# EAGLE design EurocardBackplane-test (EAGLE 6.6.0)

## Sheet 1 of 2
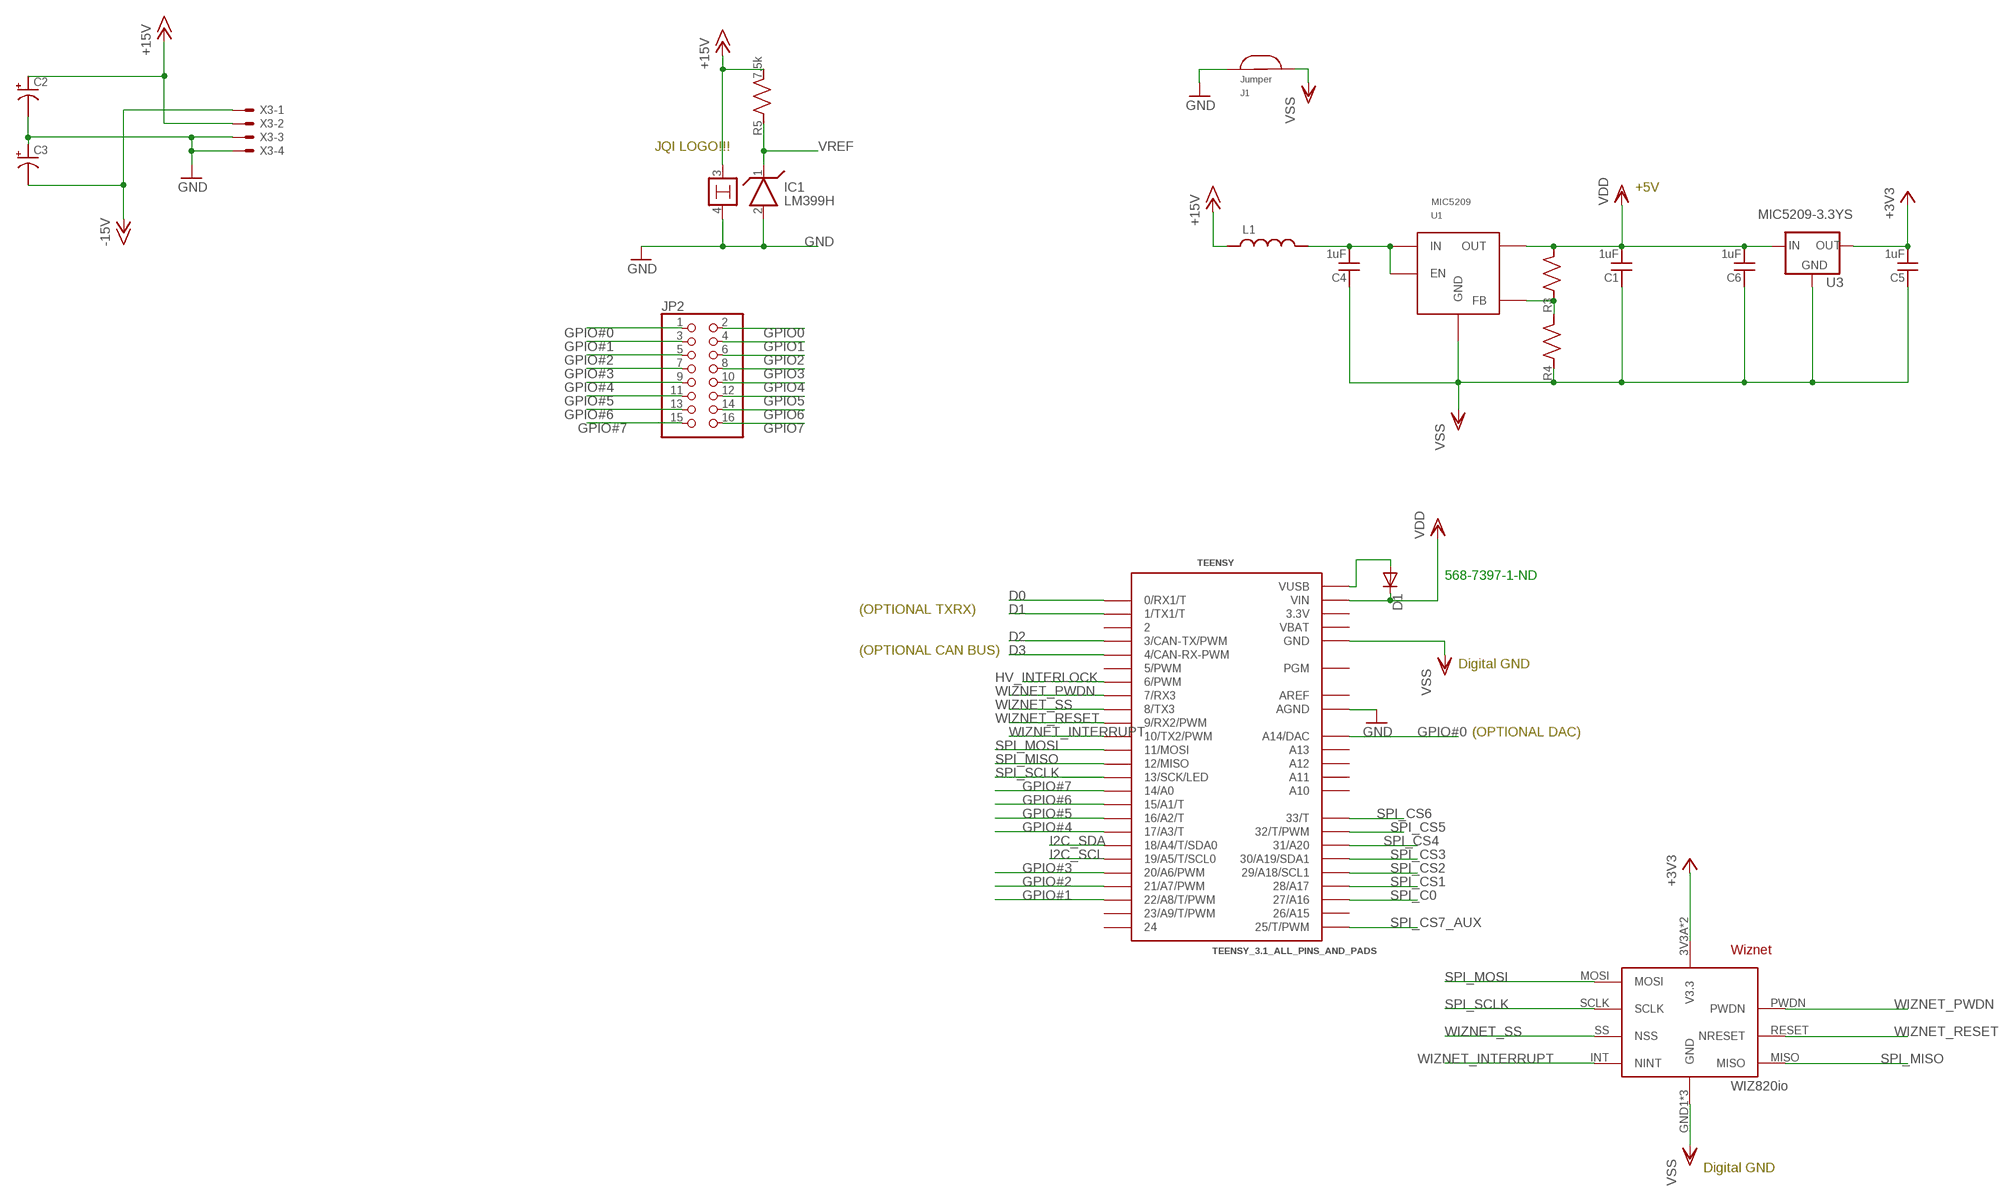
[diagram p0: schematic, sheet 1]

### Parts
C1  1uF  C_MLCC_SMDCMLCC_0603  [C_MLCC_0603]
C2  C_POL_SMDF  [PANASONIC_F]
C3  C_POL_SMDF  [PANASONIC_F]
C4  1uF  C_MLCC_SMDCMLCC_0603  [C_MLCC_0603]
C5  1uF  C_MLCC_SMDCMLCC_0603  [C_MLCC_0603]
C6  1uF  C_MLCC_SMDCMLCC_0603  [C_MLCC_0603]
D1  DIODE-SOD523  [SOD523]
IC1  LM399H  [TO39/4]
J1  JUMPER  [JUMP]
JP2  PINHD-2X8  [2X08]
L1  L_FERRITE_SMDLFERRITE_0805  [R_0805]
R3  R_SMDR0603  [R_0603]
R4  R_SMDR0603  [R_0603]
R5  7.5k  R_SMDR0603  [R_0603]
TEENSY  TEENSY_3.1_ALL_PINS_AND_PADS  [TEENSY_3.1_ALLPINS]
U1  MIC5209  [TO263-5]
U2  WIZ820IO  [WIZNET]
U3  MIC5209-3.3YS  MIC5209-FIXED  [SOT223-S]
X3  5566-4  [5566-4]

### Nets
+3V3: C5.P$2 U2.3V3A(V3.3) U2.3V3B(V3.3) U3.3(OUT)
+15V: C2.+ IC1.3 L1.P$1 R5.P$2 X3.2 ; also sheet 2
-15V: C3.- X3.1 ; also sheet 2
D0: TEENSY.0(0/RX1/T) ; also sheet 2
D1: TEENSY.1(1/TX1/T) ; also sheet 2
D2: TEENSY.3(3/CAN-TX/PWM) ; also sheet 2
D3: TEENSY.4(4/CAN-RX-PWM) ; also sheet 2
GND: C2.- C3.+ IC1.2 IC1.4 J1.P$2 TEENSY.AGND X3.3 X3.4 ; also sheet 2
GPIO0: JP2.2 ; also sheet 2
GPIO1: JP2.4 ; also sheet 2
GPIO2: JP2.6 ; also sheet 2
GPIO3: JP2.8 ; also sheet 2
GPIO4: JP2.10 ; also sheet 2
GPIO5: JP2.12 ; also sheet 2
GPIO6: JP2.14 ; also sheet 2
GPIO7: JP2.16 ; also sheet 2
GPIO#0: JP2.1 TEENSY.A14(A14/DAC)
GPIO#1: JP2.3 TEENSY.22/A8(22/A8/T/PWM)
GPIO#2: JP2.5 TEENSY.21/A7(21/A7/PWM)
GPIO#3: JP2.7 TEENSY.20/A6(20/A6/PWM)
GPIO#4: JP2.9 TEENSY.17/A3(17/A3/T)
GPIO#5: JP2.11 TEENSY.16/A2(16/A2/T)
GPIO#6: JP2.13 TEENSY.15/A1(15/A1/T)
GPIO#7: JP2.15 TEENSY.14/A0
HV_INTERLOCK: TEENSY.6(6/PWM) ; also sheet 2
I2C_SCL: TEENSY.19/A5(19/A5/T/SCL0) ; also sheet 2
I2C_SDA: TEENSY.18/A4(18/A4/T/SDA0) ; also sheet 2
N$1: C4.P$2 L1.P$2 U1.1(EN) U1.2(IN)
N$2: D1.A TEENSY.VUSB
N$5: R3.P$1 R4.P$2 U1.5(FB)
SPI_C0: TEENSY.27(27/A16)
SPI_CS1: TEENSY.28(28/A17)
SPI_CS2: TEENSY.29(29/A18/SCL1)
SPI_CS3: TEENSY.30(30/A19/SDA1)
SPI_CS4: TEENSY.31(31/A20)
SPI_CS5: TEENSY.32(32/T/PWM) ; also sheet 2
SPI_CS6: TEENSY.33(33/T) ; also sheet 2
SPI_CS7_AUX: TEENSY.25(25/T/PWM) ; also sheet 2
SPI_MISO: TEENSY.12(12/MISO) U2.MISO ; also sheet 2
SPI_MOSI: TEENSY.11(11/MOSI) U2.MOSI ; also sheet 2
SPI_SCLK: TEENSY.13(13/SCK/LED) U2.SCLK ; also sheet 2
VDD: C1.P$2 C6.P$2 D1.C R3.P$2 TEENSY.VIN U1.4(OUT) U3.1(IN)
VREF: IC1.1 R5.P$1 ; also sheet 2
VSS: C1.P$1 C4.P$1 C5.P$1 C6.P$1 J1.P$1 R4.P$1 TEENSY.GND TEENSY.GND1(GND) TEENSY.GND2(GND) U1.3(GND) U1.6(GND) U2.GND1(GND) U2.GND2(GND) U2.GND3(GND) U3.2(GND) U3.4(GND)
WIZNET_INTERRUPT: TEENSY.10(10/TX2/PWM) U2.INT(NINT)
WIZNET_PWDN: TEENSY.7(7/RX3) U2.PWDN
WIZNET_RESET: TEENSY.9(9/RX2/PWM) U2.RESET(NRESET)
WIZNET_SS: TEENSY.8(8/TX3) U2.SS(NSS)
Unconnected: TEENSY.2 TEENSY.5(5/PWM) TEENSY.23/A9(23/A9/T/PWM) TEENSY.24 TEENSY.26(26/A15) TEENSY.A10 TEENSY.A11 TEENSY.A12 TEENSY.A13 TEENSY.PGM

### Notes on the sheet
- JQI LOGO!!!
- +5V
- 568-7397-1-ND
- (OPTIONAL TXRX)
- (OPTIONAL CAN BUS)
- Digital GND
- (OPTIONAL DAC)
- Digital GND

## Sheet 2 of 2
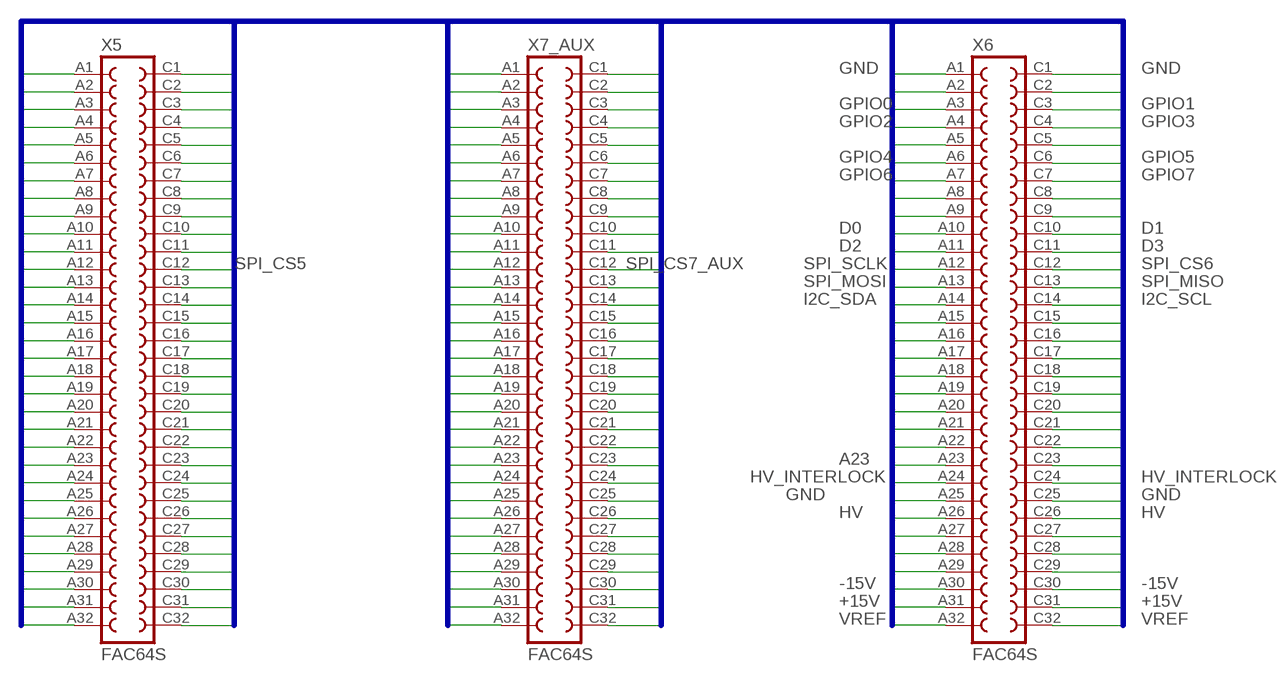
[diagram p1: schematic, sheet 2]

### Parts
X5  FAC64S  [FAC64S]
X6  FAC64S  [FAC64S]
X7_AUX  FAC64S  [FAC64S]

### Nets
+15V: X5.A31 X5.C31 X6.A31 X6.C31 X7_AUX.A31 X7_AUX.C31 ; also sheet 1
-15V: X5.A30 X5.C30 X6.A30 X6.C30 X7_AUX.A30 X7_AUX.C30 ; also sheet 1
A2: X5.A2 X6.A2 X7_AUX.A2
A5: X5.A5 X6.A5 X7_AUX.A5
A8: X5.A8 X6.A8 X7_AUX.A8
A9: X5.A9 X6.A9 X7_AUX.A9
A15: X5.A15 X6.A15 X7_AUX.A15
A16: X5.A16 X6.A16 X7_AUX.A16
A17: X5.A17 X6.A17 X7_AUX.A17
A18: X5.A18 X6.A18 X7_AUX.A18
A19: X5.A19 X6.A19 X7_AUX.A19
A20: X5.A20 X6.A20 X7_AUX.A20
A21: X5.A21 X6.A21 X7_AUX.A21
A22: X5.A22 X6.A22 X7_AUX.A22
A23: X5.A23 X6.A23 X7_AUX.A23
A27: X5.A27 X6.A27 X7_AUX.A27
A28: X5.A28 X6.A28 X7_AUX.A28
A29: X5.A29 X6.A29 X7_AUX.A29
C2: X5.C2 X6.C2 X7_AUX.C2
C5: X5.C5 X6.C5 X7_AUX.C5
C8: X5.C8 X6.C8 X7_AUX.C8
C9: X5.C9 X6.C9 X7_AUX.C9
C15: X5.C15 X6.C15 X7_AUX.C15
C16: X5.C16 X6.C16 X7_AUX.C16
C17: X5.C17 X6.C17 X7_AUX.C17
C18: X5.C18 X6.C18 X7_AUX.C18
C19: X5.C19 X6.C19 X7_AUX.C19
C20: X5.C20 X6.C20 X7_AUX.C20
C21: X5.C21 X6.C21 X7_AUX.C21
C22: X5.C22 X6.C22 X7_AUX.C22
C23: X5.C23 X6.C23 X7_AUX.C23
C27: X5.C27 X6.C27 X7_AUX.C27
C28: X5.C28 X6.C28 X7_AUX.C28
C29: X5.C29 X6.C29 X7_AUX.C29
D0: X5.A10 X6.A10 X7_AUX.A10 ; also sheet 1
D1: X5.C10 X6.C10 X7_AUX.C10 ; also sheet 1
D2: X5.A11 X6.A11 X7_AUX.A11 ; also sheet 1
D3: X5.C11 X6.C11 X7_AUX.C11 ; also sheet 1
GND: X5.A1 X5.A25 X5.C1 X5.C25 X6.A1 X6.A25 X6.C1 X6.C25 X7_AUX.A1 X7_AUX.A25 X7_AUX.C1 X7_AUX.C25 ; also sheet 1
GPIO0: X5.A3 X6.A3 X7_AUX.A3 ; also sheet 1
GPIO1: X5.C3 X6.C3 X7_AUX.C3 ; also sheet 1
GPIO2: X5.A4 X6.A4 X7_AUX.A4 ; also sheet 1
GPIO3: X5.C4 X6.C4 X7_AUX.C4 ; also sheet 1
GPIO4: X5.A6 X6.A6 X7_AUX.A6 ; also sheet 1
GPIO5: X5.C6 X6.C6 X7_AUX.C6 ; also sheet 1
GPIO6: X5.A7 X6.A7 X7_AUX.A7 ; also sheet 1
GPIO7: X5.C7 X6.C7 X7_AUX.C7 ; also sheet 1
HV: X5.A26 X5.C26 X6.A26 X6.C26 X7_AUX.A26 X7_AUX.C26
HV_INTERLOCK: X5.A24 X5.C24 X6.A24 X6.C24 X7_AUX.A24 X7_AUX.C24 ; also sheet 1
I2C_SCL: X5.C14 X6.C14 X7_AUX.C14 ; also sheet 1
I2C_SDA: X5.A14 X6.A14 X7_AUX.A14 ; also sheet 1
SPI_CS5: X5.C12 ; also sheet 1
SPI_CS6: X6.C12 ; also sheet 1
SPI_CS7_AUX: X7_AUX.C12 ; also sheet 1
SPI_MISO: X5.C13 X6.C13 X7_AUX.C13 ; also sheet 1
SPI_MOSI: X5.A13 X6.A13 X7_AUX.A13 ; also sheet 1
SPI_SCLK: X5.A12 X6.A12 X7_AUX.A12 ; also sheet 1
VREF: X5.A32 X5.C32 X6.A32 X6.C32 X7_AUX.A32 X7_AUX.C32 ; also sheet 1

### Buses
A[1..32],C[1..32]

## Power pins joined to a net without a drawn wire
3.3V: TEENSY.3.3V TEENSY.3.3V1(3.3V) TEENSY.3.3V2(3.3V)
AREF: TEENSY.AREF
VBAT: TEENSY.VBAT

## Library data of the parts
C1 C4-C6 = jqi_passives:C_MLCC_SMD
C2 C3 = jqi_passives:C_POL_SMD
D1 = diode:DIODE-: DIODE
IC1 = Eurocard-Backplane-jqi:LM399H: Precision Z DIODE
J1 = Eurocard-Backplane-jqi:JUMPER
JP2 = pinhead:PINHD-2X8: PIN HEADER
L1 = jqi_passives:L_FERRITE_SMD
R3-R5 = jqi_passives:R_SMD
TEENSY = mcu-accessories:TEENSY_3.1_ALL_PINS_AND_PADS: Footprint for Teensy 3.1 board using all pads and all through-holes. Pads need a 2x7 0.1" SMD header.
U1 = regulator-jqi:MIC5209: MIC5209YU Adjustable regulator, 500mA. Vout = 1.242(1+R2/R1), R2 less than 470k (top of divider partition).
U2 = mcu-accessories:WIZ820IO: WIZNET ethernet eval board
U3 = regulator-jqi:MIC5209-FIXED: MIC5209 positive fixed Vreg, 500mA
X3 = Eurocard-Backplane-jqi:5566-4: Mini FIT connector 4 pol Source: http://www.molex.com; OC_FARNELL: unknown; OC_NEWARK: unknown
X5 X6 X7_AUX = Eurocard-Backplane-jqi:FAC64S: CONNECTOR female, 64 pins, block, type C, rows AC, grid 5.08 mm

## Board
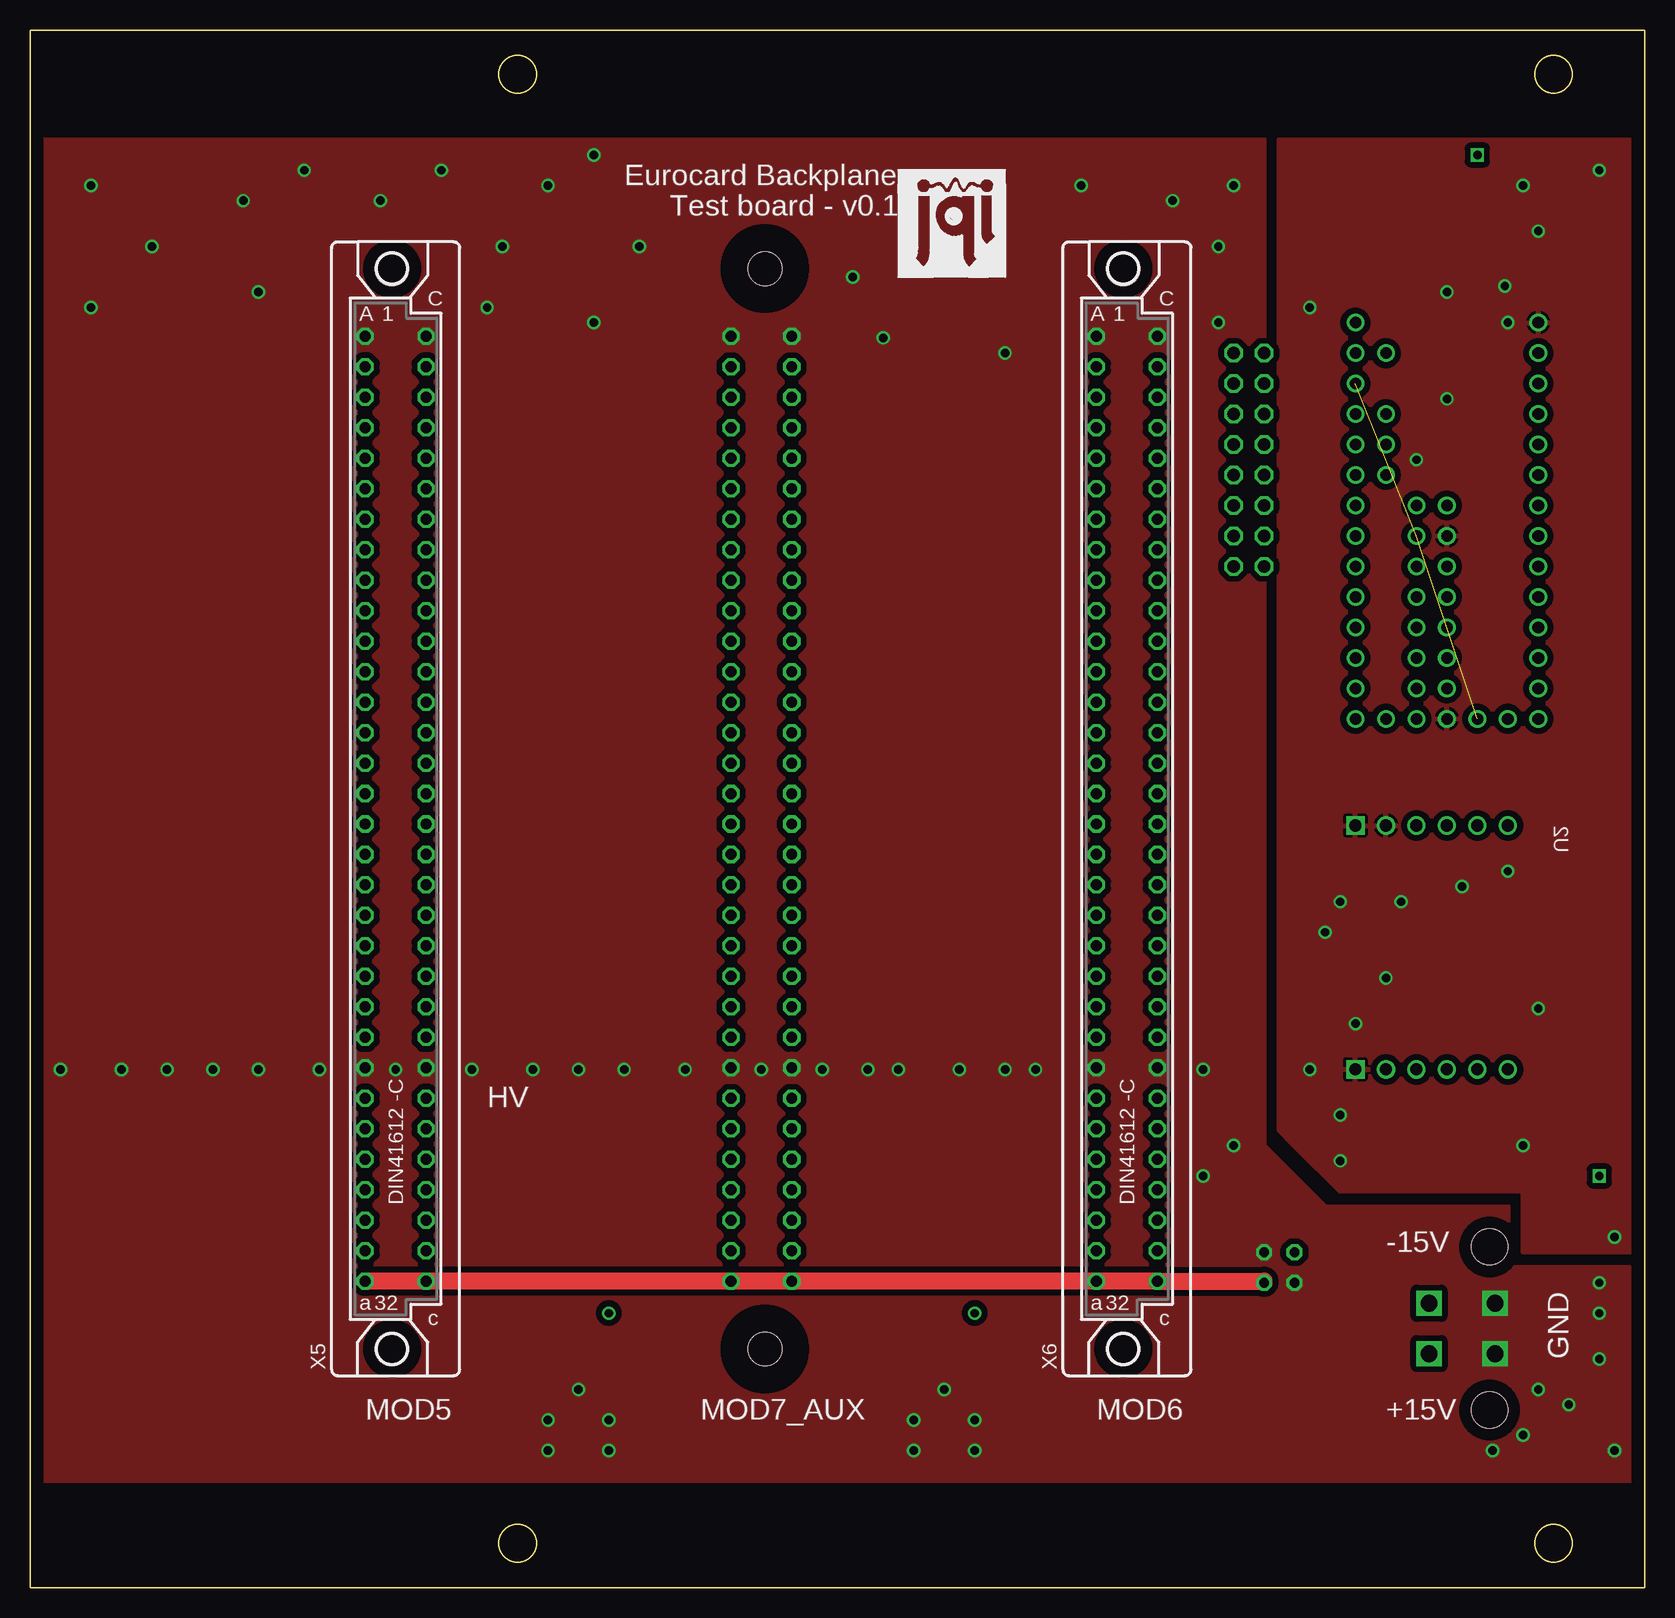
[diagram p2: board, top side]
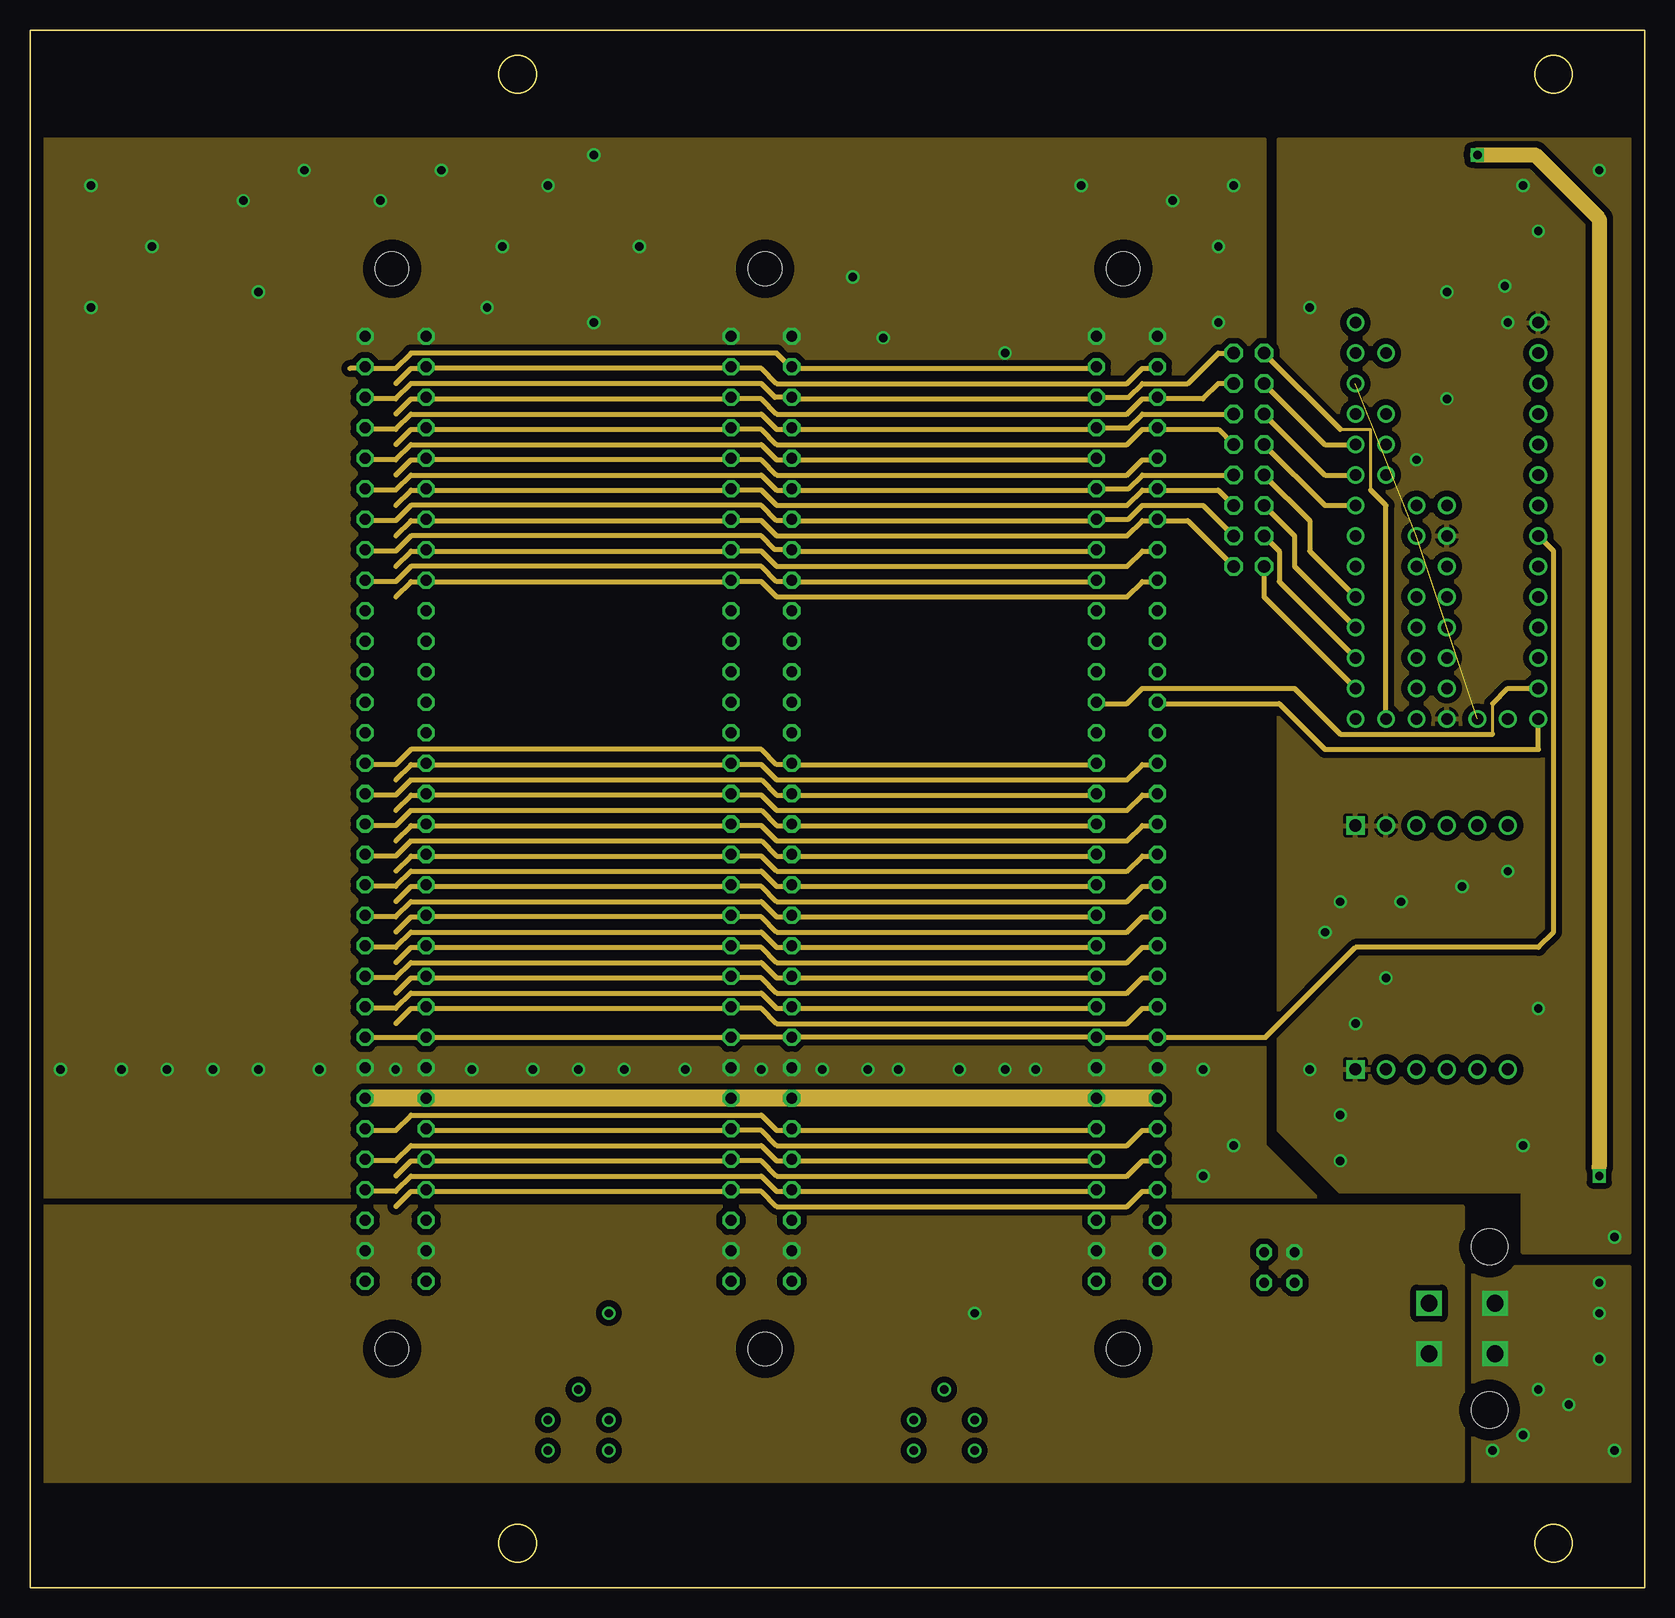
[diagram p3: board, inner layer Route2]
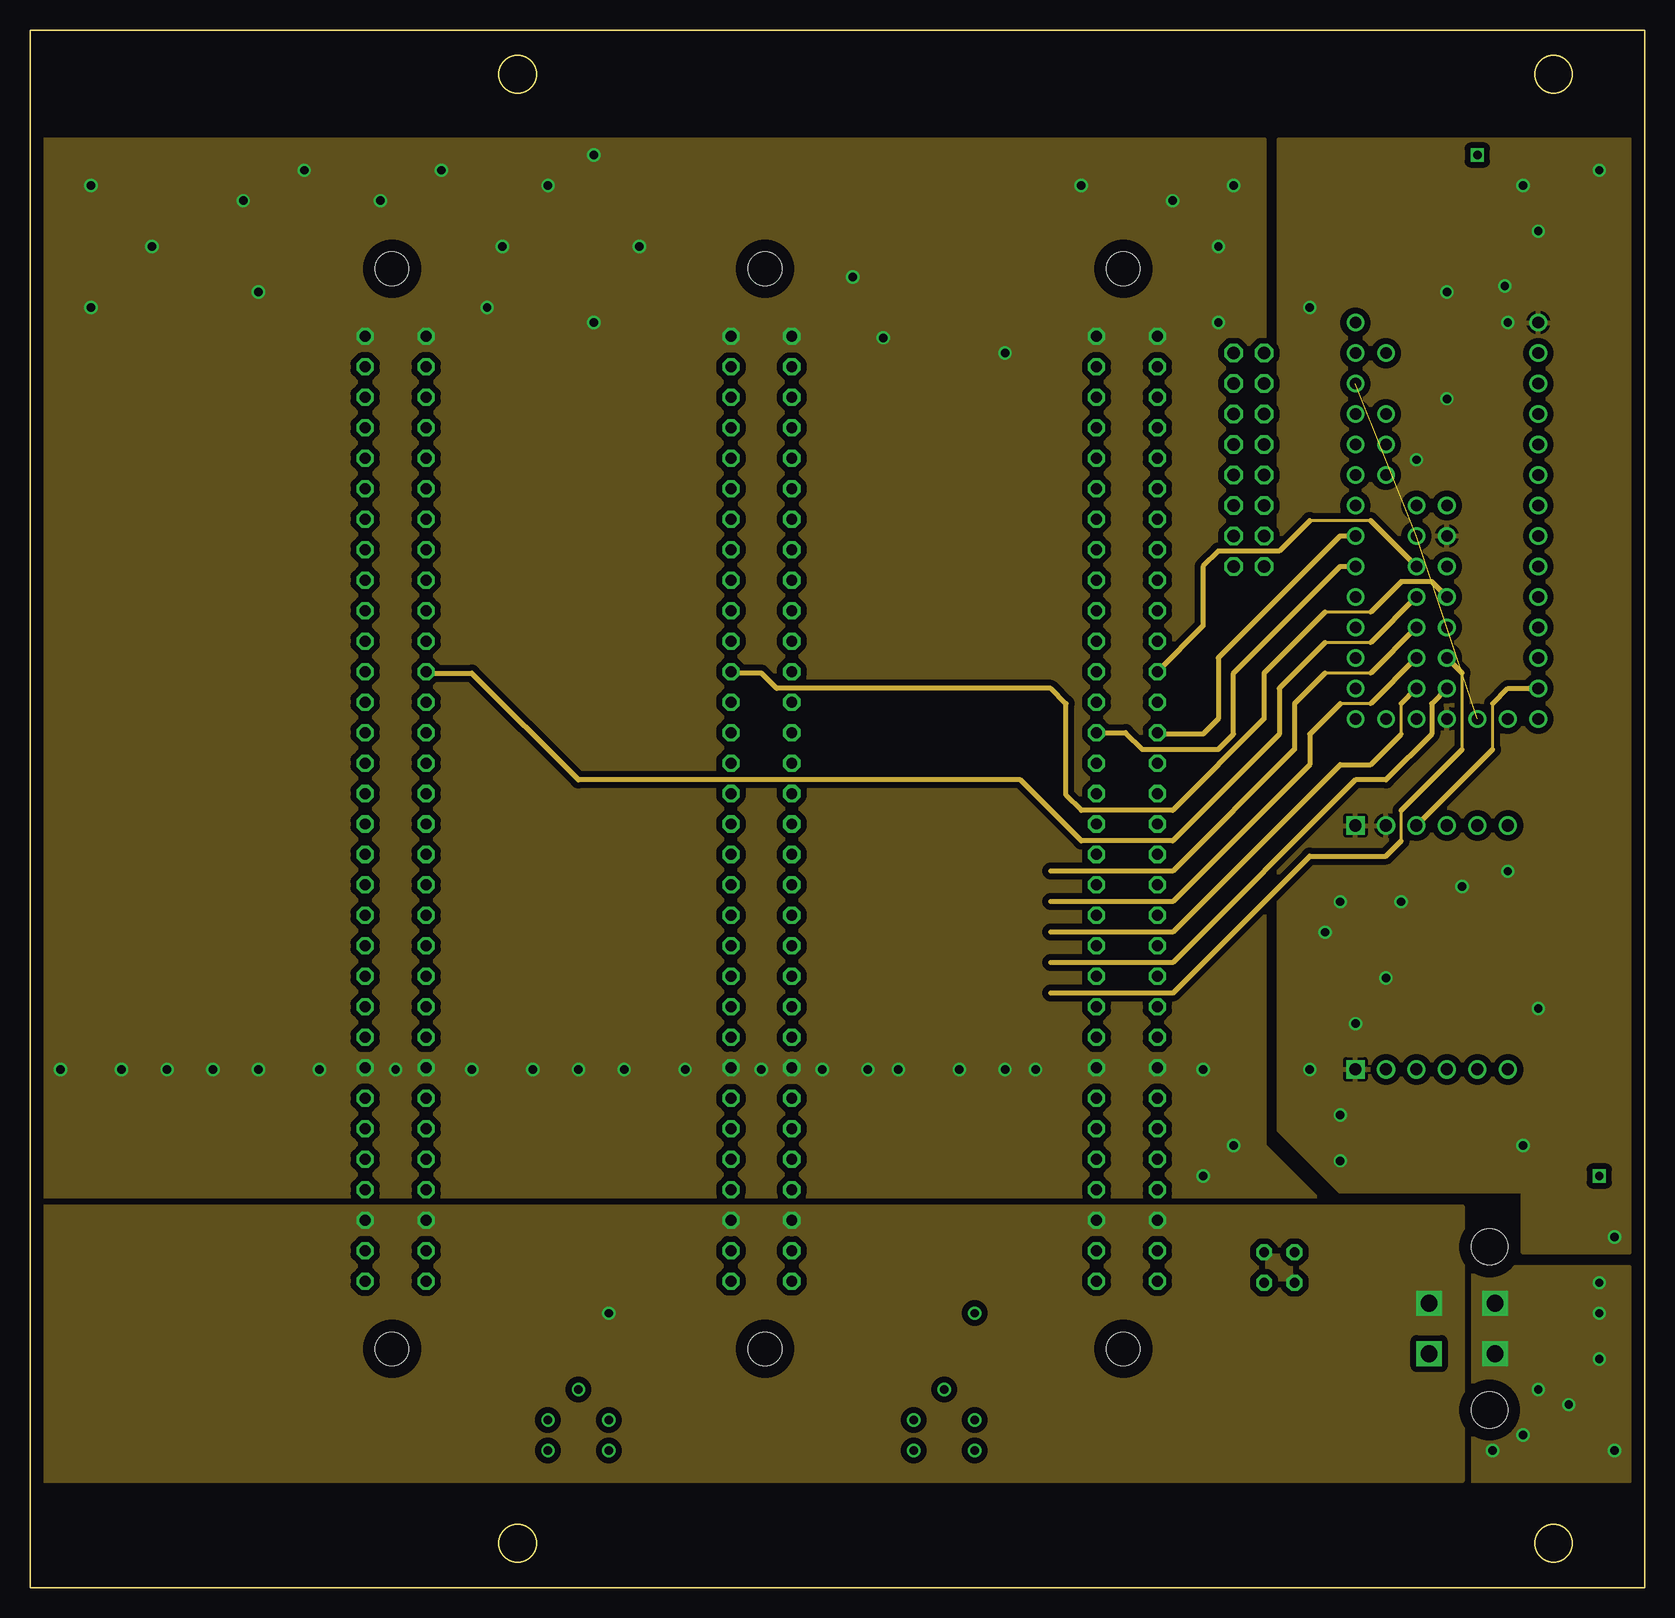
[diagram p4: board, inner layer Route15]
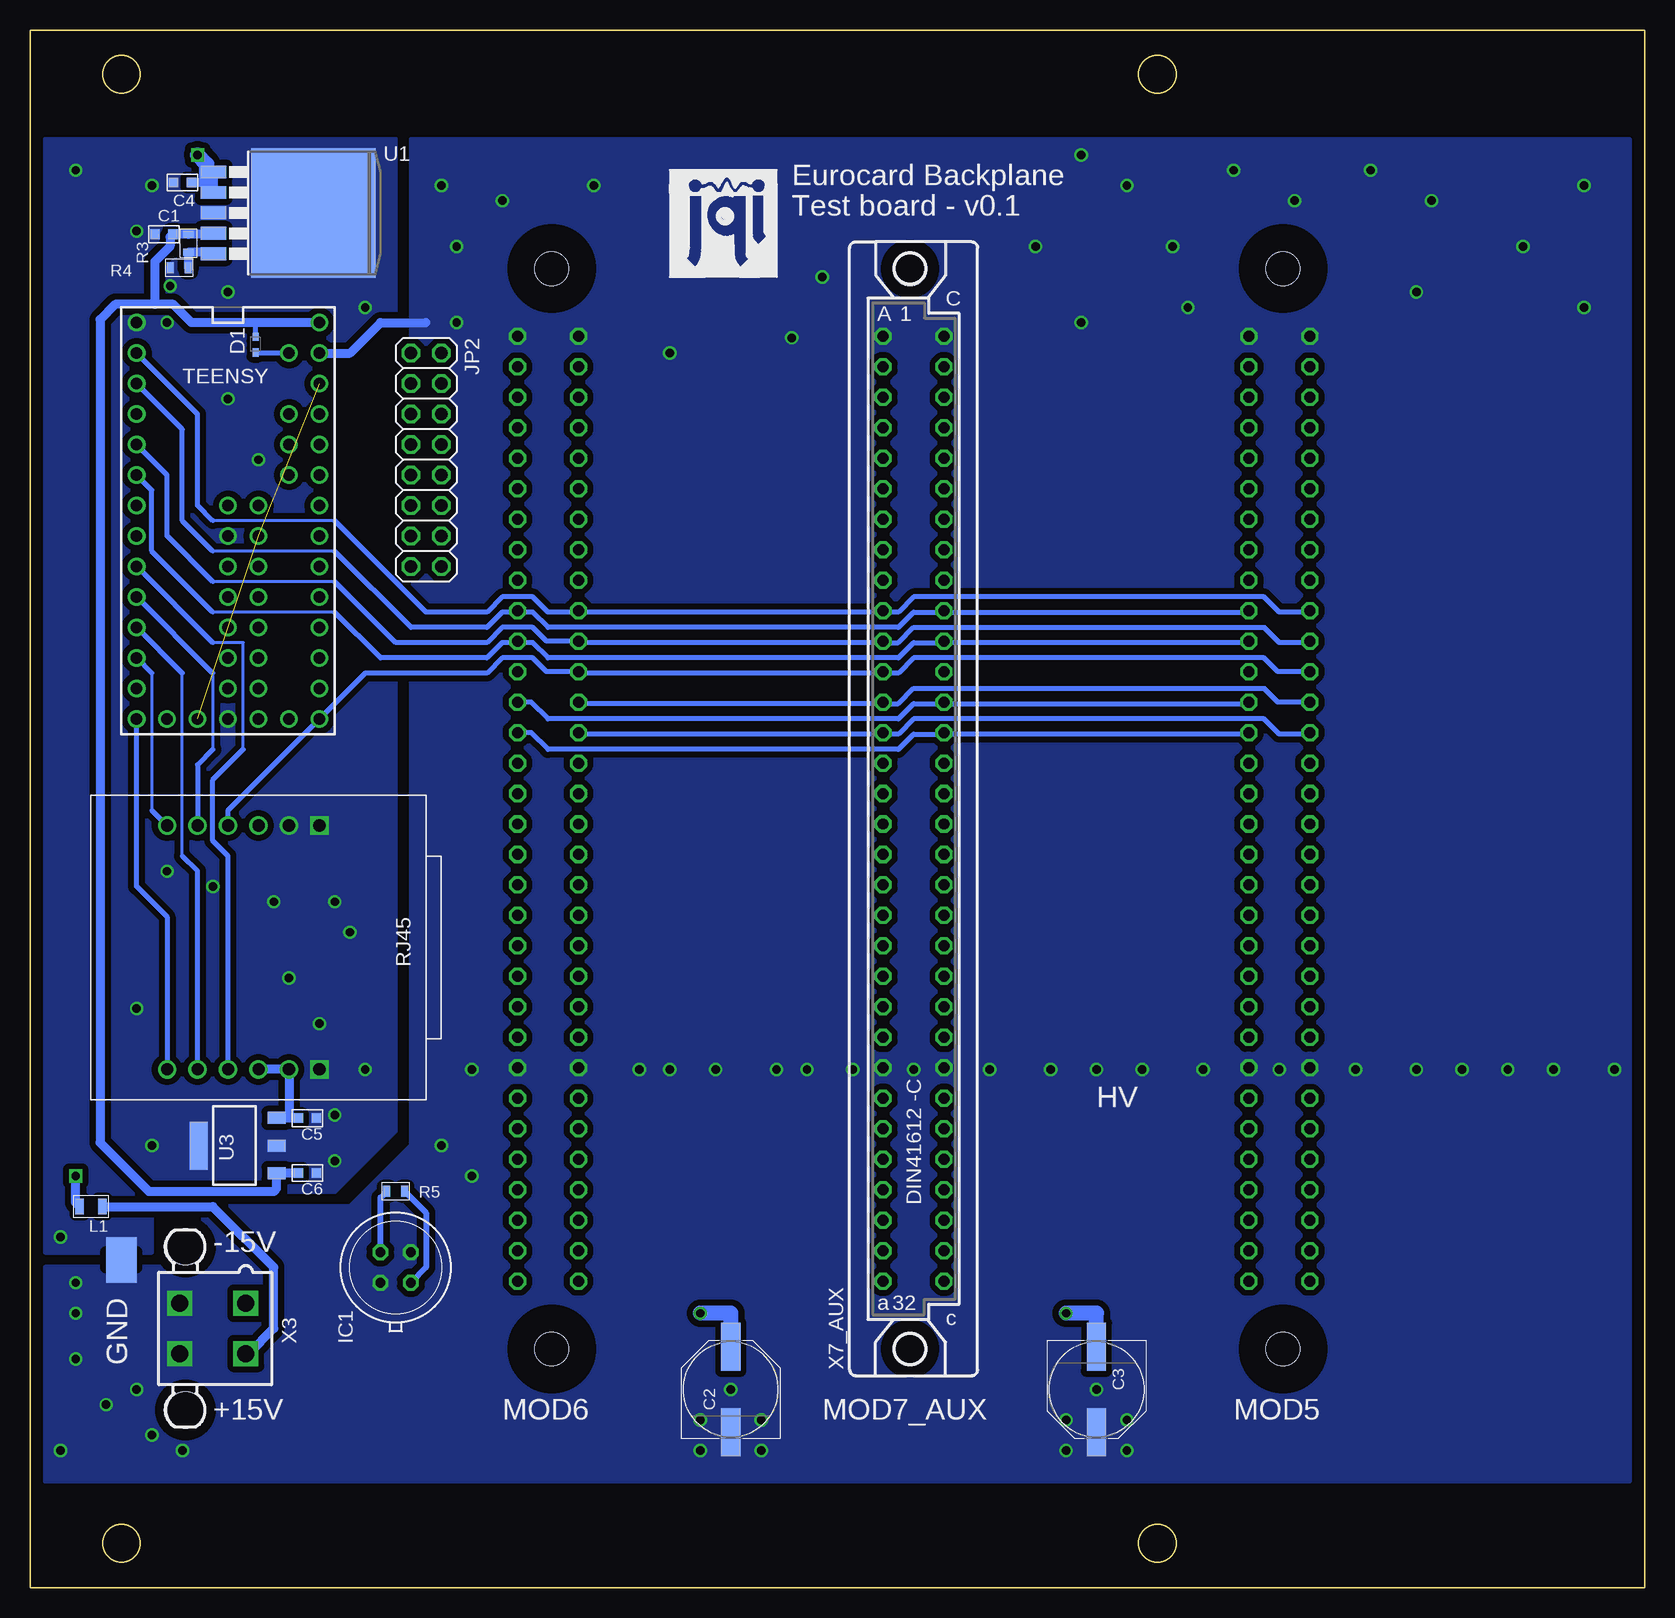
[diagram p5: board, bottom side, seen from below]

Size 134.62 x 129.79 mm. Coordinates in mm from the lower left corner, seen from the top.
Copper layers (1+2*15+16): Top 0.035mm / dielectric 1.5mm / Route2 0.035mm / dielectric 0.15mm / Route15 0.035mm / dielectric 0.2mm / Bottom 0.035mm
Design rules "default": minimum track width 10mil, minimum drill 24mil, track to track 8mil, track to pad 8mil, pad to pad 8mil, via to via 8mil, smd to smd 8mil, copper to edge 40mil, drill to drill 8mil, minimum pad ring 10mil, minimum via ring 8mil, stop-mask expansion 4mil, vias tented up to drill 0mil, thermal gap 10mil

### Footprints (pad centres in the part's own frame; a part is rotated, then mirrored left to right if it is on the bottom)
C_MLCC_0603 = smd 0.8 x 0.8: P$1 -0.75,0; P$2 0.75,0
PANASONIC_F = smd 4 x 1.6: + 3.55,0; - -3.55,0
SOD523 = smd 0.7 x 0.5: A 0.7,0; C -0.6,0
TO39/4 = drill 0.813 octagon: 1 -1.27,-1.27; 2 1.27,-1.27; 3 1.27,1.27; 4 -1.27,1.27
JUMP = smd 2.54 x 2.54: P$1 0,-1.27; P$2 0,0
2X08 = drill 1.016 octagon: 1 -8.89,-1.27; 2 -8.89,1.27; 3 -6.35,-1.27; 4 -6.35,1.27; 5 -3.81,-1.27; 6 -3.81,1.27; 7 -1.27,-1.27; 8 -1.27,1.27; 9 1.27,-1.27; 10 1.27,1.27; 11 3.81,-1.27; 12 3.81,1.27; 13 6.35,-1.27; 14 6.35,1.27; 15 8.89,-1.27; 16 8.89,1.27
R_0805 = smd 0.7 x 1.3: P$1 -0.95,0; P$2 0.95,0
R_0603 = smd 0.6 x 0.9: P$1 -0.75,0; P$2 0.75,0
TEENSY_3.1_ALLPINS = drill 0.965: 0 -7.62,15.24; 1 -7.62,12.7; 2 -7.62,10.16; 3 -7.62,7.62; 3.3V 7.62,12.7; 3.3V1 -2.54,-15.24; 3.3V2 2.54,0; 4 -7.62,5.08; 5 -7.62,2.54; 6 -7.62,0; 7 -7.62,-2.54; 8 -7.62,-5.08; 9 -7.62,-7.62; 10 -7.62,-10.16; 11 -7.62,-12.7; 12 -7.62,-15.24; 13 7.62,-15.24; 14/A0 7.62,-12.7; 15/A1 7.62,-10.16; 16/A2 7.62,-7.62; 17/A3 7.62,-5.08; 18/A4 7.62,-2.54; 19/A5 7.62,0; 20/A6 7.62,2.54; 21/A7 7.62,5.08; 22/A8 7.62,7.62; 23/A9 7.62,10.16; 24 0,-2.54; 25 0,-5.08; 26 0,-7.62; 27 0,-10.16; 28 0,-12.7; 29 2.54,-12.7; 30 2.54,-10.16; 31 2.54,-7.62; 32 2.54,-5.08; 33 2.54,-2.54; A10 5.08,7.62; A11 5.08,5.08; A12 0,2.54; A13 2.54,2.54; A14 5.08,-15.24; AGND 7.62,15.24; AREF 5.08,10.16; GND -7.62,17.78; GND1 0,-15.24; GND2 0,0; PGM 2.54,-15.24; VBAT -5.08,-15.24; VIN 7.62,17.78; VUSB 5.08,15.24
TO263-5 = smd 1.067 x 2.159: 1 -3.404,-5.791; 2 -1.702,-5.791; 3 0,-5.791; 4 1.702,-5.791; 5 3.404,-5.791 | smd 10.8 x 10.41: 6 0,2.54
WIZNET = drill 1.016: 3V3A 10.16,5.08; 3V3B 10.16,2.54; GND2 -10.16,5.08; INT -10.16,-5.08; MISO 10.16,-5.08; MOSI -10.16,2.54; PWDN 10.16,0; RESET 10.16,-2.54; SCLK -10.16,0; SS -10.16,-2.54 | drill 1.016 square: GND1 -10.16,7.62; GND3 10.16,7.62
SOT223-S = smd 1 x 1.5: 1 -2.3,-1.5; 2 0,-1.5; 3 2.3,-1.5 | smd 4 x 1.5: 4 0,5
5566-4 = drill 1.4 square: 1 2.1,-2.75; 2 -2.1,-2.75; 3 2.1,2.75; 4 -2.1,2.75 | hole 3: 6.8,2.29; -6.8,2.29
FAC64S = drill 0.914 octagon: A1 -2.54,39.37; A2 -2.54,36.83; A3 -2.54,34.29; A4 -2.54,31.75; A5 -2.54,29.21; A6 -2.54,26.67; A7 -2.54,24.13; A8 -2.54,21.59; A9 -2.54,19.05; A10 -2.54,16.51; A11 -2.54,13.97; A12 -2.54,11.43; A13 -2.54,8.89; A14 -2.54,6.35; A15 -2.54,3.81; A16 -2.54,1.27; A17 -2.54,-1.27; A18 -2.54,-3.81; A19 -2.54,-6.35; A20 -2.54,-8.89; A21 -2.54,-11.43; A22 -2.54,-13.97; A23 -2.54,-16.51; A24 -2.54,-19.05; A25 -2.54,-21.59; A26 -2.54,-24.13; A27 -2.54,-26.67; A28 -2.54,-29.21; A29 -2.54,-31.75; A30 -2.54,-34.29; A31 -2.54,-36.83; A32 -2.54,-39.37; C1 2.54,39.37; C2 2.54,36.83; C3 2.54,34.29; C4 2.54,31.75; C5 2.54,29.21; C6 2.54,26.67; C7 2.54,24.13; C8 2.54,21.59; C9 2.54,19.05; C10 2.54,16.51; C11 2.54,13.97; C12 2.54,11.43; C13 2.54,8.89; C14 2.54,6.35; C15 2.54,3.81; C16 2.54,1.27; C17 2.54,-1.27; C18 2.54,-3.81; C19 2.54,-6.35; C20 2.54,-8.89; C21 2.54,-11.43; C22 2.54,-13.97; C23 2.54,-16.51; C24 2.54,-19.05; C25 2.54,-21.59; C26 2.54,-24.13; C27 2.54,-26.67; C28 2.54,-29.21; C29 2.54,-31.75; C30 2.54,-34.29; C31 2.54,-36.83; C32 2.54,-39.37 | hole 2.794: -0.305,45.009; -0.305,-45.009

### Placement (x,y rotation side)
C1  123.44,112.78 0 bottom
C2  76.2,16.51 90 bottom
C3  45.72,16.51 270 bottom
C4  121.92,117.09 0 bottom
C5  111.51,39.12 180 bottom
C6  111.51,34.54 180 bottom
D1  115.82,103.63 270 bottom
IC1  104.14,26.67 90 bottom
J1  127,26.67 180 bottom
JP2  101.6,93.98 270 bottom
L1  129.54,31.75 180 bottom
R3  121.41,112.01 90 bottom
R4  122.17,109.98 0 bottom
R5  104.14,33.02 180 bottom
TEENSY  118.11,87.63 0 bottom
U1  113.54,114.55 270 bottom
U2  118.11,53.34 270 bottom
U3  115.57,36.83 90 bottom
U$1  [JQI_LOGO_NEGATIVE-SILKSCREEN]  72.39,109.22 0 top
U$3  [BACKPLN-PROTO]  0,0 0 top
U$4  [JQI_LOGO_NEGATIVE-SILKSCREEN]  81.28,109.22 0 bottom
X3  119.38,21.59 90 bottom
X5  30.48,64.9 0 top
X6  91.44,64.9 0 top
X7_AUX  60.96,64.9 0 bottom

### Tracks (layer width: path | path; a pad name or v marks a point on that pad's centre or on a via)
3.3V  (2 unrouted)
+3V3
  Bottom 0.762: C5.P$2 113.03,39.12 | 113.03,39.12 114.06,39.12 U3.3 | U2.3V3B U2.3V3A 113.03,39.12
+15V  (via drill 0.7)
  Bottom 0.508: IC1.3 105.41,32.5 R5.P$2
  Bottom 0.762: L1.P$1 119.38,31.75 114.3,26.67 114.3,21.59 116.4,19.49 X3.2
  Bottom 1.27: C2.+ 76.2,22.86 v78.74,22.86
  pour Route2 (isolate 0.508, no thermals): 119.38,31.75 119.38,8.89 1.27,8.89 1.27,31.75
-15V  (via drill 0.7)
  Bottom 1.27: C3.- 45.72,22.86 v48.26,22.86
  pour Route15 (isolate 0.508, no thermals): 119.38,31.75 119.38,8.89 1.27,8.89 1.27,31.75
A2
  Route2 0.406: 27.94,101.6 26.67,101.6 | 27.94,101.6 30.48,101.6 31.75,102.87 62.23,102.87 63.37,101.73 X7_AUX.A2 63.63,101.6 88.9,101.6 X6.A2 88.77,101.6 | 27.94,101.6 X5.A2
A5
  Route2 0.406: X6.A5 88.9,93.98 63.5,93.98 X7_AUX.A5 63.37,93.98 62.23,93.98 60.96,95.25 31.75,95.25 30.48,93.98 27.94,93.98 X5.A5
A8
  Route2 0.406: X6.A8 88.9,86.36 63.63,86.36 X7_AUX.A8 62.1,86.49 60.96,87.63 31.75,87.63 30.48,86.36 27.94,86.36 X5.A8
A9
  Route2 0.406: 63.5,83.82 88.9,83.82 X6.A9 | X5.A9 27.94,83.82 30.48,83.82 31.75,85.09 60.96,85.09 62.23,83.82 63.5,83.82 | 63.5,83.82 X7_AUX.A9
A15
  Route2 0.406: X6.A15 88.9,68.58 63.63,68.58 X7_AUX.A15 63.5,68.58 62.23,68.58 60.96,69.85 31.75,69.85 30.48,68.58 27.94,68.58 X5.A15
A16
  Route2 0.406: X6.A16 88.9,66.04 63.63,66.04 X7_AUX.A16 63.37,66.04 62.23,66.04 60.96,67.31 31.75,67.31 30.48,66.04 27.94,66.04 X5.A16
A17
  Route2 0.406: X6.A17 88.9,63.5 63.63,63.5 X7_AUX.A17 63.37,63.5 62.23,63.5 60.96,64.77 31.75,64.77 30.48,63.5 27.94,63.5 X5.A17
A18
  Route2 0.406: X6.A18 88.9,60.96 63.63,60.96 X7_AUX.A18 63.37,60.96 62.23,60.96 60.96,62.23 31.75,62.23 30.48,60.96 27.94,60.96 X5.A18
A19
  Route2 0.406: X6.A19 88.9,58.42 63.63,58.42 X7_AUX.A19 63.37,58.42 62.23,58.42 60.96,59.69 31.75,59.69 30.48,58.42 27.94,58.42 X5.A19
A20
  Route2 0.406: X6.A20 88.9,55.88 63.63,55.88 X7_AUX.A20 63.37,55.88 62.23,55.88 60.96,57.15 31.75,57.15 30.48,55.88 27.94,55.88 X5.A20
A21
  Route2 0.406: X6.A21 88.9,53.34 63.63,53.34 X7_AUX.A21 63.37,53.34 62.23,53.34 60.96,54.61 31.75,54.61 30.48,53.34 27.94,53.34 X5.A21
A22
  Route2 0.406: X6.A22 88.9,50.8 63.63,50.8 X7_AUX.A22 63.37,50.8 62.23,50.8 60.96,52.07 31.75,52.07 30.48,50.8 27.94,50.8 X5.A22
A23
  Route2 0.406: X6.A23 88.9,48.26 63.63,48.26 X7_AUX.A23 63.37,48.26 62.23,48.26 60.96,49.53 31.75,49.53 30.48,48.26 27.94,48.26 X5.A23
A27
  Route2 0.406: X5.A27 28.07,38.1 30.48,38.1 31.75,39.37 60.96,39.37 62.23,38.1 63.37,38.1 X7_AUX.A27 63.63,38.1 88.9,38.1 X6.A27
A28
  Route2 0.406: 63.5,35.56 88.9,35.56 X6.A28 | X5.A28 27.94,35.56 30.48,35.56 31.75,36.83 60.96,36.83 62.23,35.56 63.5,35.56 | 63.5,35.56 X7_AUX.A28
A29
  Route2 0.406: X6.A29 88.9,33.02 63.63,33.02 X7_AUX.A29 63.37,33.02 62.23,33.02 60.96,34.29 31.75,34.29 30.48,33.02 27.94,33.02 X5.A29
C2
  Route2 0.406: 93.98,101.6 X6.C2 93.85,101.6 92.71,101.6 91.44,100.33 62.23,100.33 60.96,101.6 58.55,101.6 X7_AUX.C2 58.42,101.6 33.15,101.6 X5.C2 33.02,101.6 31.75,101.6 30.48,100.33
C5
  Route2 0.406: 93.98,93.98 X6.C5 93.85,93.98 92.71,93.98 91.44,92.71 62.23,92.71 60.96,93.98 58.55,93.98 X7_AUX.C5 58.42,93.98 33.15,93.98 X5.C5 33.02,93.98 31.75,93.98 30.48,92.71
C8
  Route2 0.406: 33.02,86.36 31.75,86.36 30.48,85.09 | X6.C8 93.98,86.36 92.71,86.36 91.44,85.09 62.23,85.09 60.96,86.36 58.55,86.36 X7_AUX.C8 58.29,86.36 33.02,86.36 | X5.C8 33.02,86.36
C9
  Route2 0.406: 33.02,83.82 31.75,83.82 30.48,82.55 | X6.C9 93.98,83.82 92.71,83.82 91.44,82.55 62.23,82.55 60.96,83.82 58.55,83.82 X7_AUX.C9 58.29,83.82 33.02,83.82 | X5.C9 33.02,83.82
C15
  Route2 0.406: 33.02,68.58 31.75,68.58 30.48,67.31 | 33.02,68.58 X5.C15 | X6.C15 93.98,68.58 92.71,68.58 91.44,67.31 62.23,67.31 60.96,68.58 58.55,68.58 X7_AUX.C15 58.29,68.58 33.02,68.58
C16
  Route2 0.406: 33.02,66.04 31.75,66.04 30.48,64.77 | 33.02,66.04 X5.C16 | X6.C16 93.98,66.04 92.71,66.04 91.44,64.77 62.23,64.77 60.96,66.04 58.55,66.04 X7_AUX.C16 58.42,66.04 33.02,66.04
C17
  Route2 0.406: X6.C17 93.98,63.5 92.71,63.5 91.44,62.23 62.23,62.23 60.96,63.5 58.55,63.5 X7_AUX.C17 58.42,63.5 33.02,63.5 | 33.02,63.5 31.75,63.5 30.48,62.23 | 33.02,63.5 X5.C17
C18
  Route2 0.406: X6.C18 93.98,60.96 92.71,60.96 91.44,59.69 62.23,59.69 60.96,60.96 58.55,60.96 X7_AUX.C18 58.29,60.96 33.02,60.96 | 33.02,60.96 31.75,60.96 30.48,59.69 | 33.02,60.96 X5.C18
C19
  Route2 0.406: X6.C19 93.98,58.42 92.71,58.42 91.44,57.15 62.23,57.15 60.96,58.42 58.55,58.42 X7_AUX.C19 58.29,58.42 33.02,58.42 | 33.02,58.42 31.75,58.42 30.48,57.15 | 33.02,58.42 X5.C19
C20
  Route2 0.406: X6.C20 93.98,55.88 92.71,55.88 91.44,54.61 62.23,54.61 60.96,55.88 58.55,55.88 X7_AUX.C20 58.42,55.88 33.02,55.88 | 33.02,55.88 31.75,55.88 30.48,54.61 | 33.02,55.88 X5.C20
C21
  Route2 0.406: X6.C21 93.98,53.34 92.71,53.34 91.44,52.07 62.23,52.07 60.96,53.34 58.55,53.34 X7_AUX.C21 58.29,53.34 33.02,53.34 | 33.02,53.34 31.75,53.34 30.48,52.07 | 33.02,53.34 X5.C21
C22
  Route2 0.406: X6.C22 93.98,50.8 92.71,50.8 91.44,49.53 62.23,49.53 60.96,50.8 58.55,50.8 X7_AUX.C22 58.29,50.8 33.02,50.8 | 33.02,50.8 31.75,50.8 30.48,49.53 | 33.02,50.8 X5.C22
C23
  Route2 0.406: X6.C23 93.98,48.26 92.71,48.26 91.44,46.99 62.23,46.99 60.96,48.26 58.55,48.26 X7_AUX.C23 58.29,48.26 33.02,48.26 | 33.02,48.26 31.75,48.26 30.48,46.99 | 33.02,48.26 X5.C23
C27
  Route2 0.406: X5.C27 33.15,38.1 58.29,38.1 X7_AUX.C27 58.55,38.1 60.96,38.1 62.23,36.83 91.44,36.83 92.71,38.1 93.98,38.1 X6.C27
C28
  Route2 0.406: X6.C28 93.98,35.56 92.71,35.56 91.44,34.29 62.23,34.29 60.96,35.56 58.55,35.56 X7_AUX.C28 58.29,35.56 33.02,35.56 | 33.02,35.56 31.75,35.56 30.48,34.29 | X5.C28 33.02,35.56
C29
  Route2 0.406: X6.C29 93.98,33.02 92.71,33.02 91.44,31.75 62.23,31.75 60.96,33.02 58.55,33.02 X7_AUX.C29 58.29,33.02 33.02,33.02 | 33.02,33.02 31.75,33.02 30.48,31.75 | X5.C29 33.02,33.02
D0
  Bottom 0.254: 109.22,88.9 119.38,88.9
  Bottom 0.406: X5.A10 28.07,81.28 30.48,81.28 31.75,82.55 60.96,82.55 62.23,81.28 63.37,81.28 X7_AUX.A10 63.63,81.28 88.9,81.28 | 88.9,81.28 X6.A10 | 88.9,81.28 91.44,81.28 92.71,82.55 95.25,82.55 96.52,81.28 101.6,81.28 109.22,88.9 | TEENSY.0 120.65,97.79 120.65,90.17 119.38,88.9
D1
  Bottom 0.254: 109.22,86.36 119.38,86.36
  Bottom 0.406: TEENSY.1 121.92,96.52 121.92,88.9 119.38,86.36 | 109.22,86.36 102.87,80.01 96.52,80.01 95.25,81.28 93.98,81.28 X6.C10 93.85,81.28 92.71,81.28 91.44,80.01 62.23,80.01 60.96,81.28 58.55,81.28 X7_AUX.C10 58.42,81.28 33.15,81.28 X5.C10
D2
  Bottom 0.254: 109.22,83.82 119.38,83.82
  Bottom 0.406: X5.A11 27.94,78.74 30.48,78.74 31.75,80.01 60.96,80.01 62.23,78.74 63.5,78.74 X7_AUX.A11 63.63,78.74 88.77,78.74 X6.A11 91.57,78.87 92.71,80.01 95.25,80.01 96.52,78.74 104.14,78.74 109.22,83.82 | TEENSY.3 123.19,92.71 123.19,87.63 119.38,83.82
D3
  Bottom 0.254: 109.22,81.28 119.38,81.28
  Bottom 0.406: TEENSY.4 124.46,91.44 124.46,86.36 119.38,81.28 | 109.22,81.28 105.41,77.47 96.52,77.47 95.25,78.74 93.98,78.74 X6.C11 93.85,78.74 92.71,78.74 91.44,77.47 62.23,77.47 60.96,78.74 58.55,78.74 X7_AUX.C11 58.29,78.74 33.02,78.74 X5.C11
GND  (via drill 0.7)
  Route15 0.406: 88.9,104.14 X6.A1
  Bottom 0.762: TEENSY.AGND 107.95,102.87 105.41,105.41 101.6,105.41
  other vias: 17.78,115.57 29.21,115.57 19.05,107.95 43.18,116.84 39.37,111.76 46.99,105.41 46.99,119.38 50.8,111.76 71.12,104.14 81.28,102.87 87.63,116.84 95.25,115.57 99.06,111.76 99.06,105.41 100.33,116.84 68.58,109.22 38.1,106.68 5.08,106.68 22.86,118.11 121.92,11.43 128.27,15.24 130.81,22.86 125.73,16.51 132.08,11.43 124.46,12.7 130.81,19.05 78.74,11.43 78.74,13.97 73.66,13.97 73.66,11.43 48.26,11.43 48.26,13.97 43.18,13.97 43.18,11.43 45.72,16.51 76.2,16.51 130.81,25.4 97.79,43.18 100.33,36.83 97.79,34.29 5.08,116.84 10.16,111.76 34.29,118.11 83.82,43.18 81.28,43.18 77.47,43.18 72.39,43.18 69.85,43.18 66.04,43.18 60.96,43.18 54.61,43.18 49.53,43.18 45.72,43.18 41.91,43.18 36.83,43.18 30.48,43.18 24.13,43.18 15.24,43.18 19.05,43.18 7.62,43.18 2.54,43.18 11.43,43.18
  pour Top (isolate 0.508, rank 2, no thermals): 1.27,120.65 102.87,120.65 102.87,36.83 107.95,31.75 123.19,31.75 123.19,26.67 133.35,26.67 133.35,8.89 1.27,8.89
  pour Route2 (isolate 0.508, rank 2, no thermals): 1.27,120.65 102.87,120.65 102.87,36.83 107.95,31.75 123.19,31.75 123.19,26.67 133.35,26.67 133.35,8.89 1.27,8.89
  pour Route15 (isolate 0.508, rank 2, no thermals): 1.27,120.65 102.87,120.65 102.87,36.83 107.95,31.75 123.19,31.75 123.19,26.67 133.35,26.67 133.35,8.89 1.27,8.89
  pour Bottom (isolate 0.508, rank 2, no thermals): 1.27,120.65 102.87,120.65 102.87,36.83 107.95,31.75 123.19,31.75 123.19,26.67 133.35,26.67 133.35,8.89 1.27,8.89
GPIO0
  Route2 0.406: X5.A3 27.94,99.06 30.48,99.06 31.75,100.33 60.96,100.33 62.1,99.19 X7_AUX.A3 63.63,99.06 88.9,99.06 X6.A3 91.57,99.19 92.71,100.33 96.52,100.33 99.06,102.87 JP2.2
GPIO1
  Route2 0.406: 93.98,99.06 X6.C3 | 33.02,99.06 31.75,99.06 30.48,97.79 | X6.C3 93.85,99.06 92.71,99.06 91.44,97.79 62.23,97.79 60.96,99.06 58.55,99.06 X7_AUX.C3 58.29,99.06 33.02,99.06 | JP2.4 99.06,100.33 97.79,99.06 94.11,99.06 X6.C3 | X5.C3 33.02,99.06
GPIO2
  Route2 0.406: X5.A4 27.94,96.52 30.48,96.52 31.75,97.79 60.96,97.79 62.23,96.52 63.37,96.52 X7_AUX.A4 63.63,96.52 88.9,96.52 X6.A4 91.57,96.65 92.71,97.79 JP2.6
GPIO3
  Route2 0.406: 33.02,96.52 31.75,96.52 30.48,95.25 | 93.98,96.52 92.71,96.52 91.44,95.25 62.23,95.25 60.96,96.52 58.55,96.52 X7_AUX.C4 58.29,96.52 33.02,96.52 | 93.98,96.52 X6.C4 | 93.98,96.52 99.06,96.52 JP2.8 | X5.C4 33.02,96.52
GPIO4
  Route2 0.406: X5.A6 27.94,91.44 30.48,91.44 31.75,92.71 60.96,92.71 62.23,91.44 63.37,91.44 X7_AUX.A6 63.63,91.44 88.9,91.44 X6.A6 91.57,91.57 92.71,92.71 JP2.10
GPIO5
  Route2 0.406: 33.02,91.44 31.75,91.44 30.48,90.17 | 93.98,91.44 92.71,91.44 91.44,90.17 62.23,90.17 60.96,91.44 58.55,91.44 X7_AUX.C6 58.29,91.44 33.02,91.44 | 93.98,91.44 X6.C6 | 93.98,91.44 99.06,91.44 JP2.12 | X5.C6 33.02,91.44
  Route15 0.406: 93.98,91.44 X6.C6
GPIO6
  Route2 0.406: 63.5,88.9 88.9,88.9 X6.A7 91.57,89.03 92.71,90.17 97.79,90.17 JP2.14 | X5.A7 27.94,88.9 30.48,88.9 31.75,90.17 60.96,90.17 62.23,88.9 63.5,88.9 | 63.5,88.9 X7_AUX.A7
GPIO7
  Route2 0.406: 33.02,88.9 31.75,88.9 30.48,87.63 | 93.98,88.9 92.71,88.9 91.44,87.63 62.23,87.63 60.96,88.9 58.55,88.9 X7_AUX.C7 58.29,88.9 33.02,88.9 | 93.98,88.9 X6.C7 | 93.98,88.9 96.52,88.9 JP2.16 | X5.C7 33.02,88.9
  Route15 0.406: 93.98,88.9 X6.C7
GPIO#0
  Route2 0.254: 109.22,96.52 111.76,96.52 111.76,91.44
  Route2 0.406: JP2.1 109.22,96.52 | TEENSY.A14 113.03,90.17 111.76,91.44
GPIO#1
  Route2 0.406: JP2.3 107.95,95.25 TEENSY.22/A8
GPIO#2
  Route2 0.406: JP2.5 107.95,92.71 TEENSY.21/A7
GPIO#3
  Route2 0.406: JP2.7 107.95,90.17 TEENSY.20/A6
GPIO#4
  Route2 0.406: JP2.9 106.68,88.9 106.68,86.36 TEENSY.17/A3
GPIO#5
  Route2 0.406: JP2.11 105.41,87.63 105.41,85.09 TEENSY.16/A2
GPIO#6
  Route2 0.406: JP2.13 104.14,86.36 104.14,83.82 TEENSY.15/A1
GPIO#7
  Route2 0.406: JP2.15 102.87,82.55 TEENSY.14/A0
HV
  Route2 1.397: X6.C26 X6.A26 X7_AUX.A26 X7_AUX.C26 X5.C26 X5.A26
HV_INTERLOCK
  Route2 0.406: X5.A24 X5.C24 X7_AUX.C24 X7_AUX.A24 X6.A24 X6.C24 103,45.85 110.49,53.34 125.73,53.34 127,54.61 127,86.36 TEENSY.6
I2C_SCL
  Route15 0.406: TEENSY.19/A5 109.22,87.63 99.06,77.47 99.06,72.39 97.79,71.12 93.98,71.12 X6.C14
  Bottom 0.406: 93.98,71.12 X6.C14 92.84,71.25 91.44,69.85 62.23,69.85 60.96,71.12 58.55,71.12 X7_AUX.C14 58.29,71.12 33.02,71.12 X5.C14
I2C_SDA
  Route15 0.406: X6.A14 91.31,71.25 92.71,69.85 99.06,69.85 100.33,71.12 100.33,76.2 109.22,85.09 TEENSY.18/A4
  Bottom 0.406: X5.A14 28.07,71.12 30.48,71.12 31.75,72.39 60.96,72.39 62.23,71.12 63.37,71.12 X7_AUX.A14 63.63,71.12 88.9,71.12 X6.A14
N$1  (via drill 0.7)
  Route2 0.762: v130.81,34.29 130.81,35.05
  Route2 1.27: 130.81,35.05 130.81,114.05 125.48,119.38 v120.65,119.38
  Bottom 0.406: U1.2 119.89,116.81
  Bottom 0.762: U1.1 119.33,117.09 | 119.33,117.09 U1.2 | C4.P$2 119.89,117.09 119.33,117.09 | L1.P$2 130.81,32.07 v130.81,34.29
  Bottom 1.27: 119.89,117.09 119.89,118.62 v120.65,119.38
N$2
  Bottom 0.406: TEENSY.VUSB 115.76,102.87 D1.A
N$5
  Bottom 0.762: U1.5 119.44,111.26 R3.P$1 121.42,111.25 R4.P$2
SPI_C0
  Route15 0.254: 119.38,69.85 119.38,76.2 | 114.3,62.23 114.3,64.77
  Route15 0.406: 85.09,49.53 95.25,49.53 106.68,60.96 113.03,60.96 114.3,62.23 | 119.38,76.2 TEENSY.27 | 114.3,64.77 119.38,69.85
SPI_CS1
  Route15 0.406: 85.09,52.07 95.25,52.07 110.49,67.31 113.03,67.31 116.84,71.12 116.84,73.66 TEENSY.28
SPI_CS2
  Route15 0.254: 114.3,71.12 114.3,73.66
  Route15 0.406: 85.09,54.61 95.25,54.61 109.22,68.58 111.76,68.58 114.3,71.12 | 114.3,73.66 TEENSY.29
SPI_CS3
  Route15 0.254: 111.76,73.66 109.22,73.66
  Route15 0.406: TEENSY.30 111.76,73.66 | 109.22,73.66 106.68,71.12 106.68,68.58 95.25,57.15 85.09,57.15
SPI_CS4
  Route15 0.254: 111.76,76.2 107.95,76.2
  Route15 0.406: TEENSY.31 111.76,76.2 | 107.95,76.2 105.41,73.66 105.41,69.85 95.25,59.69 85.09,59.69
SPI_CS5
  Route15 0.254: 111.76,78.74 107.95,78.74
  Route15 0.406: TEENSY.32 111.76,78.74 | 107.95,78.74 104.14,74.93 104.14,71.12 95.25,62.23 87.63,62.23 82.55,67.31 45.72,67.31 36.83,76.2 33.15,76.2 X5.C12
SPI_CS6
  Route15 0.254: 111.76,88.9 106.68,88.9
  Route15 0.406: TEENSY.33 111.76,88.9 | 106.68,88.9 104.14,86.36 99.06,86.36 97.79,85.09 97.79,80.14 X6.C12
SPI_CS7_AUX
  Route15 0.254: 111.76,81.28 107.95,81.28
  Route15 0.406: TEENSY.25 116.84,83.82 114.3,83.82 111.76,81.28 | 107.95,81.28 102.87,76.2 102.87,72.39 95.25,64.77 87.63,64.77 86.36,66.04 86.36,73.66 85.09,74.93 62.23,74.93 60.96,76.2 58.55,76.2 X7_AUX.C12
SPI_MISO
  Route2 0.406: X6.C13 94.11,73.66 104.14,73.66 107.95,69.85 125.73,69.85 TEENSY.12
  Bottom 0.406: X6.C13 92.84,73.79 91.44,72.39 62.23,72.39 60.96,73.66 58.55,73.66 X7_AUX.C13 58.42,73.66 33.15,73.66 X5.C13 | U2.MISO 123.19,55.88 125.73,58.42 TEENSY.12
SPI_MOSI
  Route2 0.254: 121.92,71.12 121.92,73.66
  Route2 0.406: X6.A13 89.03,73.66 91.44,73.66 92.71,74.93 105.41,74.93 109.22,71.12 121.92,71.12 | 121.92,73.66 123.19,74.93 TEENSY.11
  Route15 0.254: 121.92,69.85 121.92,73.66
  Route15 0.406: U2.MOSI 121.92,69.85 | 121.92,73.66 123.19,74.93 TEENSY.11
  Bottom 0.406: X5.A13 30.61,73.79 31.75,74.93 60.96,74.93 62.23,73.66 63.5,73.66 X7_AUX.A13 63.63,73.66 88.77,73.66 X6.A13
SPI_SCLK
  Bottom 0.406: X5.A12 30.61,76.33 31.75,77.47 60.96,77.47 62.23,76.2 63.37,76.2 X7_AUX.A12 63.63,76.2 88.77,76.2 X6.A12 91.57,76.33 92.71,77.47 95.25,77.47 96.52,76.2 106.68,76.2 TEENSY.13 118.11,64.77 U2.SCLK
VDD
  Bottom 0.406: D1.C 115.82,105.41
  Bottom 0.762: C6.P$2 114.06,34.54 U3.1 114.07,33.25 114.3,33.02 124.71,33.02 128.78,37.08 128.78,105.66 127.51,106.93 124.21,106.93 | U1.4 119.42,112.76 R3.P$2 121.42,112.78 C1.P$2 122.94,112.53 122.94,111.76 124.21,110.49 124.21,106.93 | TEENSY.VIN 115.82,105.41 121.16,105.41 122.68,106.93 124.21,106.93
VREF
  Top 1.397: X5.A32 X5.C32 X7_AUX.C32 X7_AUX.A32 X6.A32 X6.C32 102.87,25.53 IC1.1
  Bottom 0.508: R5.P$1 101.6,31.23 101.6,26.67 IC1.1
VSS  (via drill 0.7)
  other vias: 132.08,29.21 124.46,36.83 109.22,39.37 109.22,35.56 106.68,43.18 113.03,50.8 109.22,57.15 114.3,57.15 119.38,58.42 123.19,59.69 125.73,48.26 118.11,99.06 115.57,93.98 123.19,105.41 118.11,107.95 106.68,106.68 130.81,118.11 125.73,113.03 124.46,116.84 122.94,108.46 110.49,46.99 107.95,54.61
  pour Top (isolate 0.508): 104.14,120.65 133.35,120.65 133.35,27.94 124.46,27.94 124.46,33.02 109.22,33.02 105.41,36.83 104.14,38.1
  pour Route2 (isolate 0.508): 104.14,120.65 133.35,120.65 133.35,27.94 124.46,27.94 124.46,33.02 109.22,33.02 104.14,38.1
  pour Route15 (isolate 0.508): 104.14,120.65 133.35,120.65 133.35,27.94 124.46,27.94 124.46,33.02 109.22,33.02 104.14,38.1
  pour Bottom (isolate 0.508, no thermals): 104.14,120.65 133.35,120.65 133.35,27.94 124.46,27.94 124.46,33.02 109.22,33.02 104.14,38.1
WIZNET_INTERRUPT
  Bottom 0.254: 124.46,76.2 124.46,64.77
  Bottom 0.406: TEENSY.10 124.46,76.2 | 124.46,64.77 U2.INT
WIZNET_PWDN
  Bottom 0.254: 116.84,69.85 116.84,78.74 119.38,78.74
  Bottom 0.406: U2.PWDN 118.11,60.96 119.38,62.23 119.38,67.31 116.84,69.85 | TEENSY.7 119.38,78.74
WIZNET_RESET
  Bottom 0.254: 121.92,60.96 121.92,76.2
  Bottom 0.406: U2.RESET 120.65,59.69 121.92,60.96 | 121.92,76.2 TEENSY.9
WIZNET_SS
  Bottom 0.254: 119.38,76.2 119.38,69.85
  Bottom 0.406: 119.38,76.2 TEENSY.8 | 119.38,69.85 120.65,68.58 U2.SS

### Text on the board
tPlace: Eurocard Backplane | Test board - v0.1 | HV | -15V | GND | MOD5 | MOD7_AUX | MOD6 | +15V
bPlace: Eurocard Backplane | Test board - v0.1 | HV | -15V | GND | MOD5 | MOD7_AUX | MOD6 | +15V